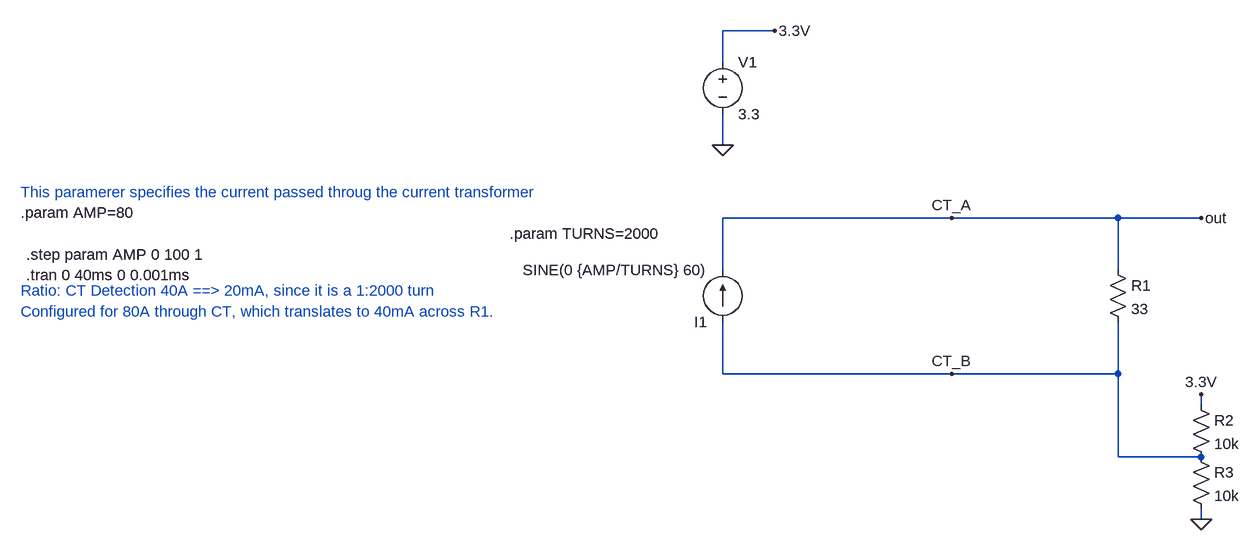
[diagram p0: schematic CT Bias Only.asc]
CT Bias Only.asc, the LTspice schematic file:
Version 4
SHEET 1 1904 680
WIRE 176 -240 96 -240
WIRE 96 -192 96 -240
WIRE 96 -64 96 -112
WIRE 448 48 96 48
WIRE 704 48 448 48
WIRE 832 48 704 48
WIRE 96 128 96 48
WIRE 704 128 704 48
WIRE 96 288 96 208
WIRE 448 288 96 288
WIRE 704 288 704 208
WIRE 704 288 448 288
WIRE 832 336 832 320
WIRE 704 416 704 288
WIRE 832 416 704 416
WIRE 832 512 832 496
FLAG 832 48 out
FLAG 96 -64 0
FLAG 176 -240 3.3V
FLAG 832 512 0
FLAG 832 320 3.3V
FLAG 448 48 CT_A
FLAG 448 288 CT_B
SYMBOL current 96 208 R180
WINDOW 123 0 0 Left 2
WINDOW 39 0 0 Left 2
SYMATTR InstName I1
SYMATTR Value SINE(0 {AMP/TURNS} 60)
SYMBOL res 688 112 R0
SYMATTR InstName R1
SYMATTR Value 33
SYMBOL res 816 320 R0
SYMATTR InstName R2
SYMATTR Value 10k
SYMBOL res 816 400 R0
SYMATTR InstName R3
SYMATTR Value 10k
SYMBOL voltage 96 -208 R0
SYMATTR InstName V1
SYMATTR Value 3.3
TEXT -984 160 Left 2 ;Ratio: CT Detection 40A ==> 20mA, since it is a 1:2000 turn
TEXT -976 136 Left 2 !.tran 0 40ms 0 0.001ms
TEXT -984 192 Left 2 ;Configured for 80A through CT, which translates to 40mA across R1.
TEXT -984 40 Left 2 !.param AMP=80
TEXT -984 8 Left 2 ;This paramerer specifies the current passed throug the current transformer
TEXT -976 104 Left 2 !.step param AMP 0 100 1
TEXT -232 72 Left 2 !.param TURNS=2000

The netlist it stands for:
* CT Bias Only.asc
I1 CT_B CT_A SINE(0 {AMP/TURNS} 60)
R1 CT_A CT_B 33
R2 3.3V CT_B 10k
R3 CT_B 0 10k
V1 3.3V 0 3.3
* Ratio: CT Detection 40A ==> 20mA, since it is a 1:2000 turn
.tran 0 40ms 0 0.001ms
* Configured for 80A through CT, which translates to 40mA across R1.
.param AMP=80
* This paramerer specifies the current passed throug the current transformer
.step param AMP 0 100 1
.param TURNS=2000
.backanno
.end